# Altium schematic sheet kopplingsschema_hyttmodul.SchDoc
size A4
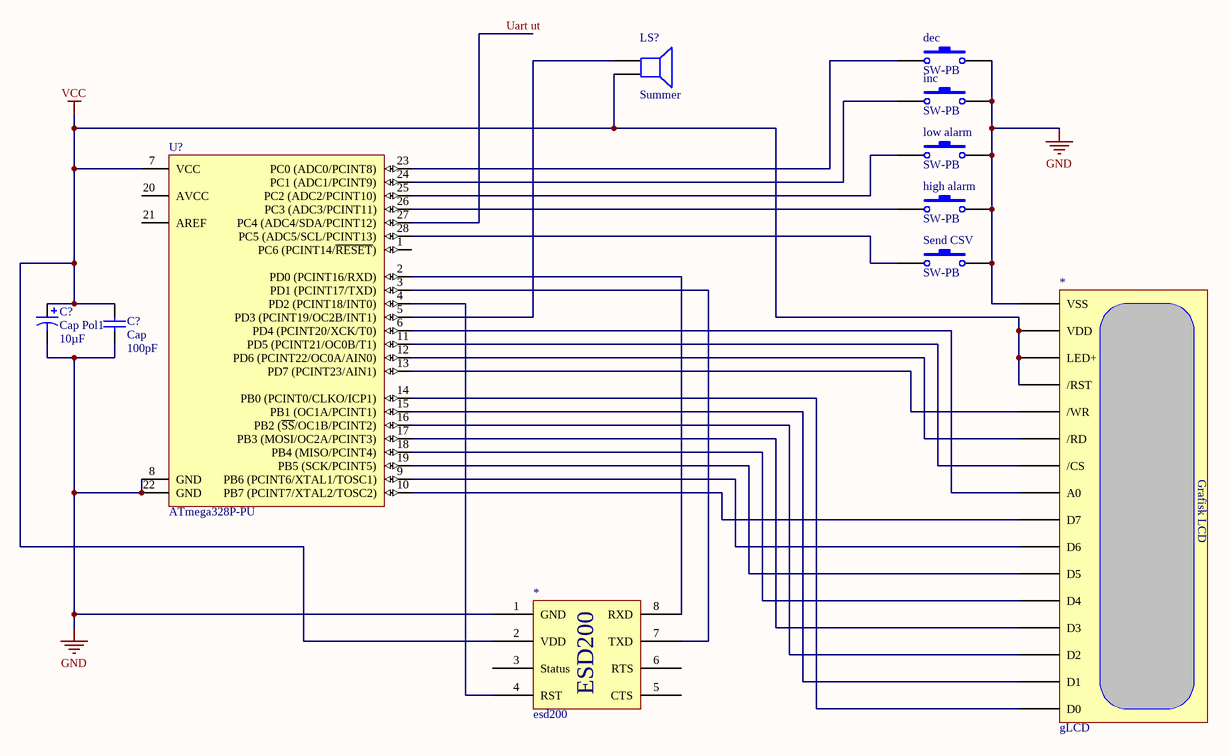
[diagram p0: kopplingsschema_hyttmodul.SchDoc]

## Parts
(Parts that share a designator on the sheet are numbered #1, #2 ... from top to bottom, then left to right.)
*#1  gLCD
*#2  esd200
C?#1  Cap Pol1  value 10µF  [RB7.6-15]
C?#2  Cap  value 100pF  [RAD-0.3]
dec  SW-PB  [SPST-2]
high_alarm  SW-PB  [SPST-2]
inc  SW-PB  [SPST-2]
low_alarm  SW-PB  [SPST-2]
LS?  Summer  [PIN2]
Send_CSV  SW-PB  [SPST-2]
U?  ATmega328P-PU  [28P3]

## Nets
GND: *#1.8(VSS) *#2.1(GND) C?#1.2 C?#2.1 dec.2 high_alarm.2 inc.2 low_alarm.2 Send_CSV.2 U?.8(GND) U?.22(GND)
VCC: *#1.9(VDD) *#1.10(LED+) *#1.11(/RST) *#2.2(VDD) C?#1.1 C?#2.2 LS?.2 U?.7(VCC)
Uart ut: U?.27(PC4_(ADC4/SDA/PCINT12))
Net*#1_0: *#1.0(D0) U?.14(PB0_(PCINT0/CLKO/ICP1))
Net*#1_1: *#1.1(D1) U?.15(PB1_(OC1A/PCINT1))
Net*#1_2: *#1.2(D2) U?.16(PB2_(~{SS}/OC1B/PCINT2))
Net*#1_3: *#1.3(D3) U?.17(PB3_(MOSI/OC2A/PCINT3))
Net*#1_4: *#1.4(D4) U?.18(PB4_(MISO/PCINT4))
Net*#1_5: *#1.5(D5) U?.19(PB5_(SCK/PCINT5))
Net*#1_6: *#1.6(D6) U?.9(PB6_(PCINT6/XTAL1/TOSC1))
Net*#1_7: *#1.7(D7) U?.10(PB7_(PCINT7/XTAL2/TOSC2))
Net*#1_12: *#1.12(/WR) U?.13(PD7_(PCINT23/AIN1))
Net*#1_13: *#1.13(/RD) U?.12(PD6_(PCINT22/OC0A/AIN0))
Net*#1_14: *#1.14(/CS) U?.11(PD5_(PCINT21/OC0B/T1))
Net*#1_15: *#1.15(A0) U?.6(PD4_(PCINT20/XCK/T0))
Net*#2_4: *#2.4(RST) U?.4(PD2_(PCINT18/INT0))
Net*#2_7: *#2.7(TXD) U?.3(PD1_(PCINT17/TXD))
Net*#2_8: *#2.8(RXD) U?.2(PD0_(PCINT16/RXD))
Netdec_1: dec.1 U?.23(PC0_(ADC0/PCINT8))
Nethigh_alarm_1: high_alarm.1 U?.26(PC3_(ADC3/PCINT11))
Netinc_1: inc.1 U?.24(PC1_(ADC1/PCINT9))
Netlow_alarm_1: low_alarm.1 U?.25(PC2_(ADC2/PCINT10))
NetLS?_1: LS?.1 U?.5(PD3_(PCINT19/OC2B/INT1))
NetSend_CSV_1: Send_CSV.1 U?.28(PC5_(ADC5/SCL/PCINT13))

Not connected (* = marked no-connect by the designer): *#2 3(Status) 5(CTS) 6(RTS); U? 1(PC6_(PCINT14/~{RESET})) 20(AVCC) 21(AREF)

## Notes on the sheet
- (in symbol esd200) ESD200
- (in symbol gLCD) Grafisk LCD

## Library data of the parts
C?#1 = Cap Pol1: Polarized Capacitor (Radial); Published: 8-Jun-2000; LatestRevisionDate: 17-Jul-2002; LatestRevisionNote: Re-released for DXP Platform.; PackageReference: RB7.6-15; Publisher: Altium Limited; PackageDescription: Polarized Capacitor (Radial); 2 Leads
C?#2 = Cap: Capacitor; Published: 8-Jun-2000; LatestRevisionDate: 17-Jul-2002; LatestRevisionNote: Re-released for DXP Platform.; PackageReference: RAD-0.3; Publisher: Altium Limited; PackageDescription: Radial Cap, Thru-Hole; 2 Leads; 0.3 in Pin Spacing
dec high_alarm inc low_alarm Send_CSV = SW-PB: Switch; Published: 24-Mar-1999; LatestRevisionDate: 17-Jul-2002; LatestRevisionNote: Re-released for DXP Platform.; PackageReference: SPST-2; Publisher: Altium Limited; PackageDescription: Switch; 2 Leads
LS? = Speaker: Loudspeaker; Published: 24-Mar-1999; LatestRevisionDate: 17-Jul-2002; LatestRevisionNote: Re-released for DXP Platform.; PackageReference: PIN2; Publisher: Altium Limited
U? = ATmega328P-PU: 8-bit AVR Microcontroller, 32KB Flash, 1KB EEPROM, 2KB SRAM, 28-pin PDIP, Industrial Grade (-40°C to 85°C); Published: 1-Apr-2010; DatasheetVersion: revA, Jan-2010; PackageVersion: revB, Sep-2001; PackageReference: 28P3; Publisher: Altium Limited; PackageDescription: 28-lead (0.300"/7.62mm Wide) Plastic Dual Inline Package (PDIP); Supplier 1: Digi-Key; Supplier Part Number 1: ATMEGA328P-PU-ND; Supplier 2: Farnell; Supplier Part Number 2: 1715487; Supplier 3: Mouser; Supplier Part Number 3: 556-ATMEGA328P-PU; ComponentLink1Description: Manufacturer Link; ComponentLink1URL: http://www.atmel.com/products/avr/default.asp?; ComponentLink2Description: ATmega48A/48PA/88A/88PA/168A/168PA/328/328P Datasheet; ComponentLink2URL: http://www.atmel.com/dyn/resources/prod_documents/8271.pdf; ComponentLink3Description: ATmega48A/48PA/88A/88PA/168A/168PA/328/328P Summary; ComponentLink3URL: http://www.atmel.com/dyn/resources/prod_documents/8271S.pdf; ComponentLink4Description: Atmel.com Home; ComponentLink4URL: http://www.atmel.com